# EAGLE design mechanical-endstop (EAGLE 5.06)
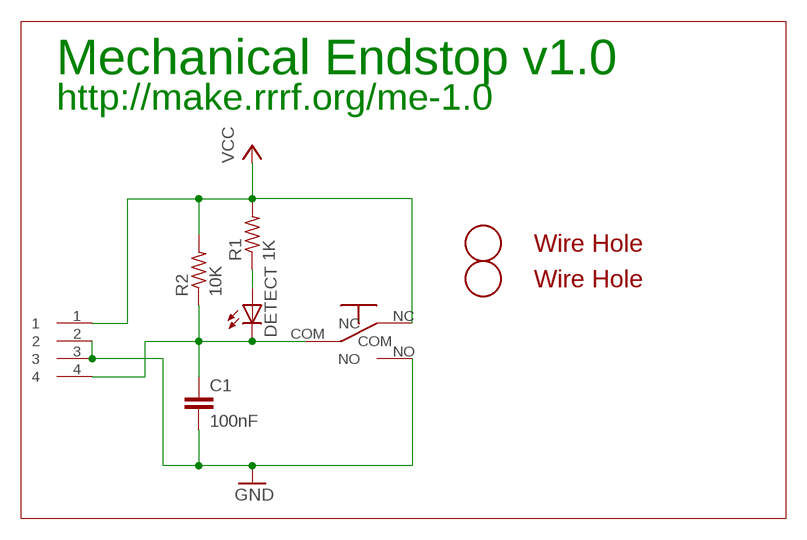
[diagram p0: schematic, sheet 1]

## Parts
C1  100nF  C-EUC1206  [C1206]
DETECT  LEDCHIPLED_1206  [CHIPLED_1206]
R1  1K  R-US_R1206  [R1206]
R2  10K  R-US_R1206  [R1206]
U$1  CDROM  [70553-04]
U$2  OMRON-D2FA  [OMRON-D2F-A]
U$5  3MMHOLE  [3MMHOLE]
U$6  3MMHOLE  [3MMHOLE]

## Nets
GND: C1.2 U$1.2 U$1.3 U$2.NO
N$1: DETECT.A R1.1
N$2: C1.1 DETECT.C R2.1 U$1.4 U$2.COM
VCC: R1.2 R2.2 U$1.1 U$2.NC

## Notes on the sheet
- Mechanical Endstop v1.0
- http://make.rrrf.org/me-1.0

## Library data of the parts
C1 = rcl:C-EU: CAPACITOR, European symbol
DETECT = led:LED: LED OSRAM: - CHIPLED LG R971, LG N971, LY N971, LG Q971, LY Q971, LO R971, LY R971 LH N974, LH R974 LS Q976, LO Q976, LY Q976 LO Q996 - Hyper CHIPLED LW Q18S LB Q993, LB Q99A, LB R99A - SideLED LS A670, LO A670, LY A670, LG A670, LP A670 LB A673, LV A673, LT A673, LW A673 LH A674 LY A675 LS A676, LA A676, LO A676, LY A676, LW A676 LS A679, LY A679, LG A679 - Hyper Micro SIDELED® LS Y876, LA Y876, LO Y876, LY Y876 LT Y87S - SmartLED LW L88C, LW L88S LB L89C, LB L89S, LG L890 LS L89K, LO L89K, LY L89K LS L896, LA L896, LO L896, LY L896 - TOPLED LS T670, LO T670, LY T670, LG T670, LP T670 LSG T670, LSP T670, LSY T670, LOP T670, LYG T670 LG T671, LOG T671, LSG T671 LB T673, LV T673, LT T673, LW T673 LH T674 LS T676, LA T676, LO T676, LY T676, LB T676, LH T676, LSB T676, LW T676 LB T67C, LV T67C, LT T67C, LS T67K, LO T67K, LY T67K, LW E67C LS E67B, LA E67B, LO E67B, LY E67B, LB E67C, LV E67C, LT E67C LW T67C LS T679, LY T679, LG T679 LS T770, LO T770, LY T770, LG T770, LP T770 LB T773, LV T773, LT T773, LW T773 LH T774 LS E675, LA E675, LY E675, LS T675 LS T776, LA T776, LO T776, LY T776, LB T776 LHGB T686 LT T68C, LB T68C - Hyper Mini TOPLED® LB M676 - Mini TOPLED Santana® LG M470 LS M47K, LO M47K, LY M47K Source: http://www.osram.convergy.de LUXEON: - LUMILED® LXK2-PW12-R00, LXK2-PW12-S00, LXK2-PW14-U00, LXK2-PW14-V00 LXK2-PM12-R00, LXK2-PM12-S00, LXK2-PM14-U00 LXK2-PE12-Q00, LXK2-PE12-R00, LXK2-PE12-S00, LXK2-PE14-T00, LXK2-PE14-U00 LXK2-PB12-K00, LXK2-PB12-L00, LXK2-PB12-M00, LXK2-PB14-N00, LXK2-PB14-P00, LXK2-PB14-Q00 LXK2-PR12-L00, LXK2-PR12-M00, LXK2-PR14-Q00, LXK2-PR14-R00 LXK2-PD12-Q00, LXK2-PD12-R00, LXK2-PD12-S00 LXK2-PH12-R00, LXK2-PH12-S00 LXK2-PL12-P00, LXK2-PL12-Q00, LXK2-PL12-R00 Source: www.luxeon.com KINGBRIGHT: KA-3528ASYC Source: www.kingbright.com
R1 R2 = rcl:R-US_: RESISTOR, American symbol
U$1 = reprap:CDROM
U$2 = reprap:OMRON-D2F
U$5 U$6 = reprap:3MMHOLE

## Net classes
0 default: width 0.813 mm, drill 0.635 mm, clearance 0.635 mm

## Board
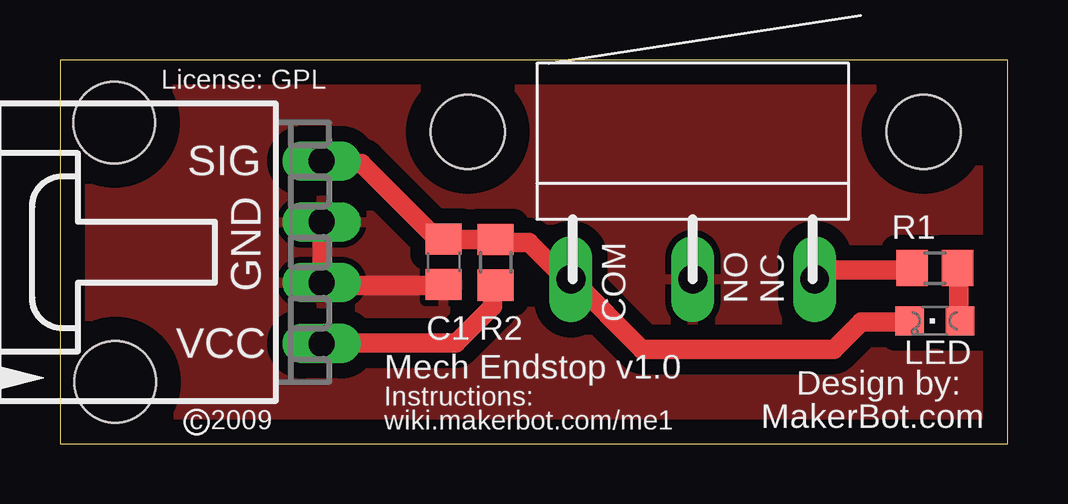
[diagram p1: board, top side]
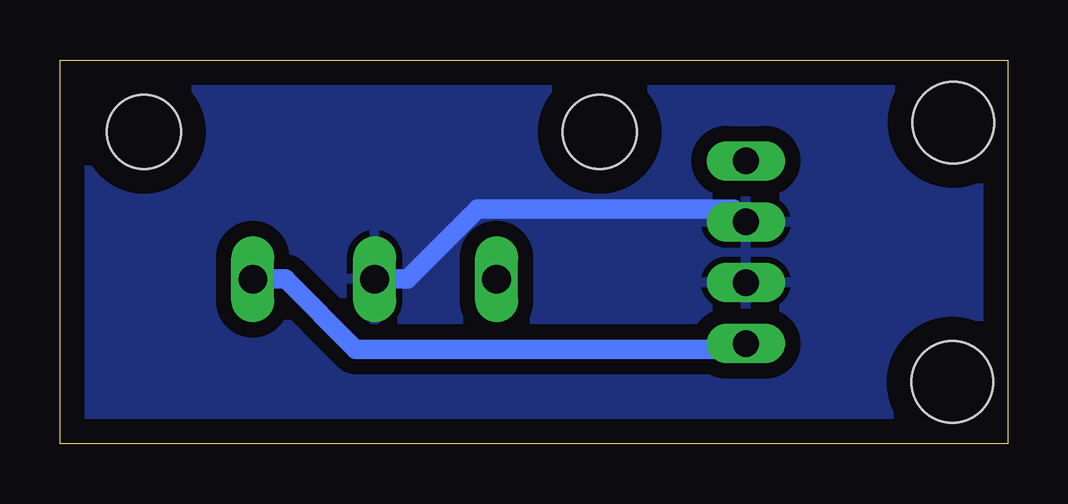
[diagram p2: board, bottom side, seen from below]

Size 39.5 x 16 mm. Coordinates in mm from the lower left corner, seen from the top.
Outline: 0,0 39.5,0 39.5,16 0,16 0,0
Copper layers (1*16): Top 0.035mm / dielectric 1.5mm / Bottom 0.035mm
Design rules "default": minimum track width 10mil, minimum drill 24mil, track to track 8mil, track to pad 8mil, pad to pad 8mil, via to via 8mil, smd to smd 8mil, copper to edge 40mil, drill to drill 8mil, minimum pad ring 10mil, minimum via ring 8mil, stop-mask expansion 4mil, vias tented up to drill 0mil, thermal gap 10mil

### Footprints (pad centres in the part's own frame; a part is rotated, then mirrored left to right if it is on the bottom)
C0805 = smd 1.3 x 1.5: 1 -0.95,0; 2 0.95,0
CHIPLED_0805 = smd 1.2 x 1.2: A 0,-1.05; C 0,1.05
R0805 = smd 1.3 x 1.5: 1 -0.95,0; 2 0.95,0
70553-04 = drill 1.092 long: 1 -3.81,-7.62; 2 -1.27,-7.62; 3 1.27,-7.62; 4 3.81,-7.62 | hole 3.4: -5.41,0.98; 5.41,1.02
OMRON-D2F-A = drill 1.2 long: COM -5.08,0; NC 5.08,0; NO 0,0
3MMHOLE = hole 3.1: 0,0

### Placement (x,y rotation side)
C1  100nF  [C0805]  16,7.58 270 top
DETECT  [CHIPLED_0805]  36.47,5.12 90 top
R1  1K  [R0805]  36.47,7.32 180 top
R2  10K  [R0805]  18.16,7.56 270 top
U$1  3.29,7.98 90 top
U$2  26.38,6.86 0 top
U$5  17,13 0 top
U$6  36,13 0 top

### Tracks (layer width: path | path; a pad name or v marks a point on that pad's centre or on a via)
GND
  Top 0.813: C1.2 15.88,6.6 10.92,6.6 U$1.2 10.92,7.11 10.92,9.14 U$1.3
  Bottom 0.813: U$2.NO 25.02,6.86 22.1,9.78 11.43,9.78 10.92,9.27 U$1.3
  pour Top: -1.27,16.51 40.64,16.51 40.64,-1.27 -1.27,-1.27
  pour Bottom: -1.27,16.51 40.64,16.51 40.64,-1.27 -1.27,-1.27
N$1
  Top 0.813: DETECT.A 37.47,5.21 37.47,7.24 R1.1
N$2
  Top 0.813: DETECT.C 35.31,5.08 33.4,5.08 32.26,3.94 24.26,3.94 21.34,6.86 U$2.COM 20.95,6.99 19.56,8.38 18.54,8.38 R2.1 18.03,8.51 16,8.51 C1.1 15.62,8.64 12.57,11.68 10.92,11.68 U$1.4
VCC
  Top 0.813: R1.2 35.43,7.24 31.88,7.24 31.5,6.86 U$2.NC | R2.2 18.03,6.6 18.03,5.71 16.51,4.19 10.92,4.19 U$1.1
  Bottom 0.813: U$2.NC 30.1,6.86 27.18,3.94 11.05,3.94 10.92,4.06 U$1.1

### Text on the board
tPlace: License: GPL | SIG | GND | VCC | Mech Endstop v1.0 | LED | Instructions: | Design by: | c 2009 | wiki.makerbot.com/me1 | MakerBot.com